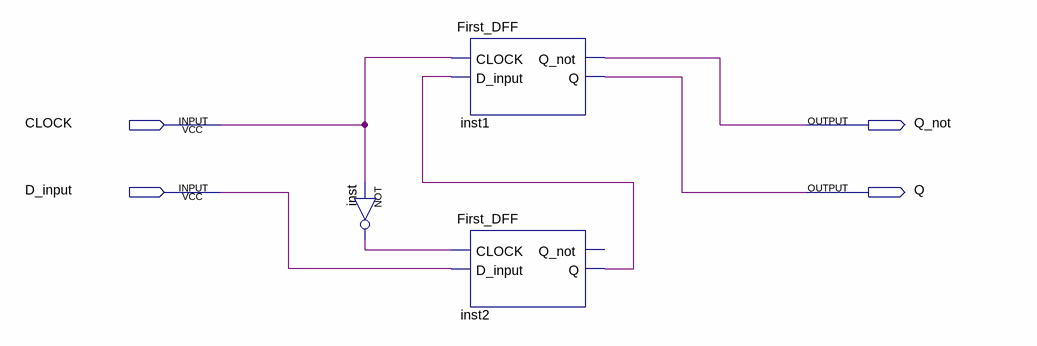
[diagram p0: schematic sheet]
// Quartus schematic Edge_DFF.bdf as structural Verilog: 3 symbols, 4 pins
module Edge_DFF (
  input  CLOCK,
  input  D_input,
  output Q_not,
  output Q
);

  wire inst2_q, inst_out;

  not inst (inst_out, CLOCK);
  First_DFF inst1 (.CLOCK(CLOCK), .D_input(inst2_q), .Q_not(Q_not), .Q(Q));
  First_DFF inst2 (.CLOCK(inst_out), .D_input(D_input), .Q(inst2_q));  // open: Q_not
endmodule
